# Altium schematic sheet 01-MSP430.SchDoc
size A4; DocumentNumber: 17; SheetNumber: 17; SheetTotal: 34
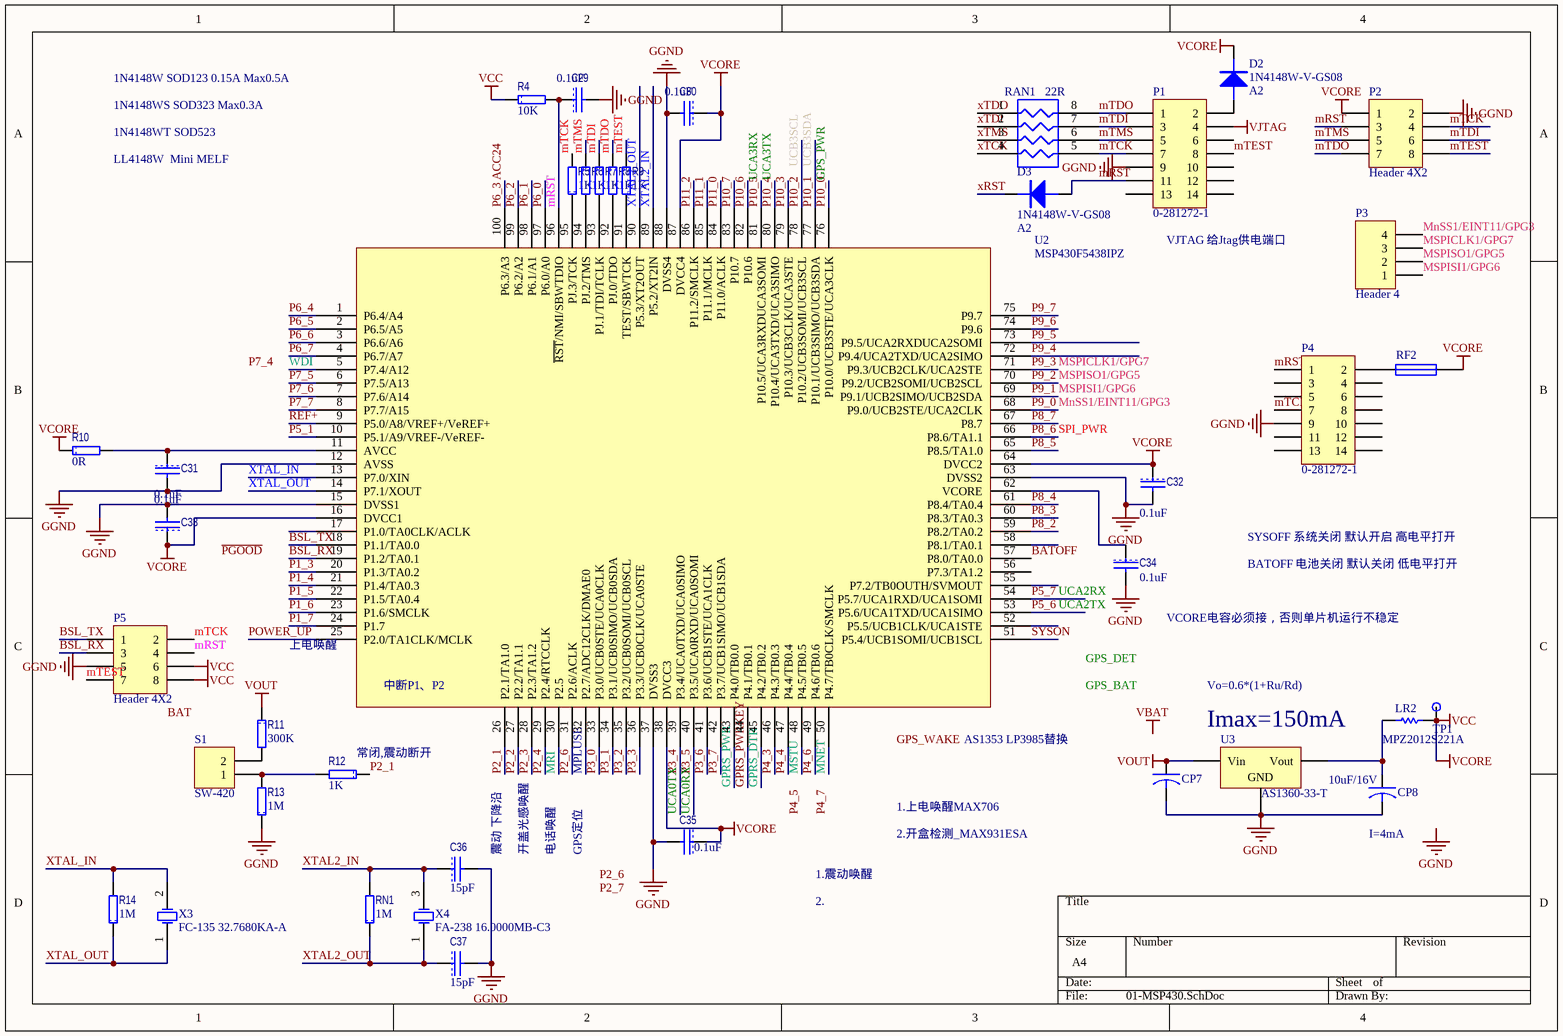
[diagram p0: 01-MSP430.SchDoc]

## Parts
C29  value 0.1uF  [1608[0603]C]  (hidden comment: C1608X7R1H104K)
C30  value 0.1uF  [1608[0603]C]  (hidden comment: C1608X7R1H104K)
C31  value 0.1uF  [1608[0603]C]  (hidden comment: C1608X7R1H104K)
C32  value 0.1uF  [1608[0603]C]  (hidden comment: C1608X7R1H104K)
C33  value 0.1uF  [1608[0603]C]  (hidden comment: C1608X7R1H104K)
C34  value 0.1uF  [1608[0603]C]  (hidden comment: C1608X7R1H104K)
C35  value 0.1uF  [1608[0603]C]  (hidden comment: C1608X7R1H104K)
C36  value 15pF  [1608[0603]]  (hidden comment: C1608C0G1H150J)
C37  value 15pF  [1608[0603]]  (hidden comment: C1608C0G1H150J)
CP7  TAJA106K016RNJ  [3216[1206]CB]  (value not drawn)
CP8  value 10uF/16V  [3216[1206]CB]  (hidden comment: TAJA106K016RNJ)
D2  1N4148W-V-GS08  value A2  [SOD123]
D3  1N4148W-V-GS08  value A2  [SOD123]
LR2  MPZ2012S221A  [2012[0805]]
P1  0-281272-1  [HDR2X7]
P2  Header 4X2  [HDR2X4]
P3  Header 4  [HDR1X4]
P4  0-281272-1  [HDR2X7]
P5  Header 4X2  [HDR2X4]
R4  value 10K  [1608[0603]R]  (hidden comment: CRCW060310K0FKEA)
R5  value 1K  [1608[0603]R]  (hidden comment: CRCW06031K00FKEA)
R6  value 1K  [1608[0603]R]  (hidden comment: CRCW06031K00FKEA)
R7  value 1K  [1608[0603]R]  (hidden comment: CRCW06031K00FKEA)
R8  value 1K  [1608[0603]R]  (hidden comment: CRCW06031K00FKEA)
R9  value 1K  [1608[0603]R]  (hidden comment: CRCW06031K00FKEA)
R10  value 0R  [1608[0603]R]  (hidden comment: CRCW06030000ZSTA)
R11  value 300K  [1608[0603]R]  (hidden comment: CRCW0603300KFKEA)
R12  value 1K  [1608[0603]R]  (hidden comment: CRCW06031K00FKEA)
R13  value 1M  [1608[0603]R]  (hidden comment: CRCW06031M00FKEA)
R14  value 1M  [1608[0603]R]  (hidden comment: CRCW06031M00FKEA)
RAN1  value 22R  [R-AR4]  (hidden comment: CRA06S08322R0JTA)
RF2  0805L050WR  [2012[0805]F]  (value not drawn)
RN1  value 1M  [1608[0603]RN]  (hidden comment: CRCW06031M00FKEA)
S1  SW-420  [SW-420]
TP1  TP  [TP]  (value not drawn)
U2  MSP430F5438IPZ  [TQFP100_N]
U3  AS1360-33-T  [SOT23_N]
X3  FC-135 32.7680KA-A  [FC-135]
X4  FA-238 16.0000MB-C3  [FA-238]

## Nets
GGND: C29.2 C30.2 C31.2 C32.2 C33.2 C34.2 C35.2 C36.2 C37.2 CP7.2 CP8.2 P1.9 P2.2 P4.9 P5.5 R13.1 U2.12(AVSS) U2.15(DVSS1) U2.37(DVSS3) U2.63(DVSS2) U2.88(DVSS4) U3.1(GND)
VCC: C30.1 C32.1 C33.1 C35.1 D2.2(K) LR2.1 P2.1 P5.6 P5.8 R4.1 R10.1 RF2.2 TP1.1(TestPoint) U2.16(DVCC1) U2.38(DVCC3) U2.64(DVCC2) U2.87(DVCC4)  [also labelled VCORE]
VJTAG: P1.4
VOUT: CP7.1 R11.1 U3.3(Vin)
ACC24: U2.100(P6.3/A3)  [also labelled P6_3]
BATOFF: U2.57(P8.0/TA0.0)
BSL_RX: P5.3 U2.19(P1.2/TA0.1)
BSL_TX: P5.1 U2.18(P1.1/TA0.0)
GPRS_DTR: U2.45(P4.2/TB0.2)
GPRS_PWR: U2.43(P4.0/TB0.0)
GPRS_PWRKEY: U2.44(P4.1/TB0.1)
GPS_PWR: U2.76(P10.0/UCB3STE/UCA3CLK)  [also labelled P10_0]
MNET: U2.50(P4.7/TB0CLK/SMCLK)
MnSS1/EINT11/GPG3: P3.4 U2.68(P9.0/UCB2STE/UCA2CLK)  [also labelled P9_0]
MPLUSE: U2.32(P2.7/ADC12CLK/DMAE0)
MRI: U2.30(P2.5)
mRST: C29.1 D3.1(A) P1.11 P2.3 P4.1 P5.4 R4.2 U2.96(~{RST}/NMI/SBWTDIO)
MSPICLK1/GPG7: P3.3 U2.71(P9.3/UCB2CLK/UCA2STE)  [also labelled P9_3]
MSPISI1/GPG6: P3.1 U2.69(P9.1/UCB2SIMO/UCB2SDA)  [also labelled P9_1]
MSPISO1/GPG5: P3.2 U2.70(P9.2/UCB2SOMI/UCB2SCL)  [also labelled P9_2]
MSTU: U2.48(P4.5/TB0.5)
mTCK: P1.7 P2.4 P4.7 P5.2 R5.2 RAN1.5(R4)
mTDI: P1.3 P2.6 R7.1 RAN1.7(R2)
mTDO: P1.1 P2.7 R8.1 RAN1.8(R1)
mTEST: P1.8 P2.8 P5.7 R9.1
mTMS: P1.5 P2.5 R6.1 RAN1.6(R3)
P1_3: U2.20(P1.3/TA0.2)
P1_4: U2.21(P1.4/TA0.3)
P1_5: U2.22(P1.5/TA0.4)
P1_6: U2.23(P1.6/SMCLK)
P1_7: U2.24(P1.7)
P2_1: R12.1 U2.26(P2.1/TA1.0)
P2_2: U2.27(P2.2/TA1.1)
P2_3: U2.28(P2.3/TA1.2)
P2_4: U2.29(P2.4/RTCCLK)
P2_6: U2.31(P2.6/ACLK)
P3_0: U2.33(P3.0/UCB0STE/UCA0CLK)
P3_1: U2.34(P3.1/UCB0SIMO/UCB0SDA)
P3_2: U2.35(P3.2/UCB0SOMI/UCB0SCL)
P3_3: U2.36(P3.3/UCB0CLK/UCA0STE)
P3_4: U2.39(P3.4/UCA0TXD/UCA0SIMO)  [also labelled UCA0TX]
P3_5: U2.40(P3.5/UCA0RXD/UCA0SOMI)  [also labelled UCA0RX]
P3_6: U2.41(P3.6/UCB1STE/UCA1CLK)
P3_7: U2.42(P3.7/UCB1SIMO/UCB1SDA)
P4_3: U2.46(P4.3/TB0.3)
P4_4: U2.47(P4.4/TB0.4)
P4_6: U2.49(P4.6/TB0.6)
P5_1: U2.10(P5.1/A9/VREF-/VeREF-)
P5_6: U2.53(P5.6/UCA1TXD/UCA1SIMO)  [also labelled UCA2TX]
P5_7: U2.54(P5.7/UCA1RXD/UCA1SOMI)  [also labelled UCA2RX]
P6_0: U2.97(P6.0/A0)
P6_1: U2.98(P6.1/A1)
P6_2: U2.99(P6.2/A2)
P6_4: U2.1(P6.4/A4)
P6_5: U2.2(P6.5/A5)
P6_6: U2.3(P6.6/A6)
P6_7: U2.4(P6.7/A7)
P7_5: U2.6(P7.5/A13)
P7_6: U2.7(P7.6/A14)
P7_7: U2.8(P7.7/A15)
P8_2: U2.59(P8.2/TA0.2)
P8_3: U2.60(P8.3/TA0.3)
P8_4: U2.61(P8.4/TA0.4)
P8_5: U2.65(P8.5/TA1.0)
P8_6: U2.66(P8.6/TA1.1)  [also labelled SPI_PWR]
P8_7: U2.67(P8.7)
P9_4: U2.72(P9.4/UCA2TXD/UCA2SIMO)
P9_5: U2.73(P9.5/UCA2RXDUCA2SOMI)
P9_6: U2.74(P9.6)
P9_7: U2.75(P9.7)
P10_1: U2.77(P10.1/UCB3SIMO/UCB3SDA)  [also labelled UCB3SDA]
P10_2: U2.78(P10.2/UCB3SOMI/UCB3SCL)  [also labelled UCB3SCL]
P10_3: U2.79(P10.3/UCB3CLK/UCA3STE)
P10_4: U2.80(P10.4/UCA3TXD/UCA3SIMO)  [also labelled UCA3TX]
P10_5: U2.81(P10.5/UCA3RXDUCA3SOMI)  [also labelled UCA3RX]
P10_6: U2.82(P10.6)
P10_7: U2.83(P10.7)
P11_0: U2.84(P11.0/ACLK)
P11_1: U2.85(P11.1/MCLK)
P11_2: U2.86(P11.2/SMCLK)
POWER_UP: U2.25(P2.0/TA1CLK/MCLK)
REF+: U2.9(P5.0/A8/VREF+/VeREF+)
SYSON: U2.51(P5.4/UCB1SOMI/UCB1SCL)
WDI: U2.5(P7.4/A12)
xRST: D3.2(K)
XTAL2_IN: C36.1 RN1.2 U2.89(P5.2/XT2IN) X4.3(OSC2)
XTAL2_OUT: C37.1 RN1.1 U2.90(P5.3/XT2OUT) X4.1(OSC1)
XTAL_IN: R14.2 U2.13(P7.0/XIN) X3.2(OSC2)
XTAL_OUT: R14.1 U2.14(P7.1/XOUT) X3.1(OSC1)
xTCK: RAN1.4(R4)
xTDI: RAN1.2(R2)
xTDO: RAN1.1(R1)
xTMS: RAN1.3(R3)
NetC31_1: C31.1 R10.2 U2.11(AVCC)
NetC34_1: C34.1 U2.62(VCORE)
NetCP8_1: CP8.1 LR2.2 U3.2(Vout)
NetD2_1: D2.1(A) P1.2
NetR5_1: R5.1 U2.95(PJ.3/TCK)
NetR6_2: R6.2 U2.94(PJ.2/TMS)
NetR7_2: R7.2 U2.93(PJ.1/TDI/TCLK)
NetR8_2: R8.2 U2.92(PJ.0/TDO)
NetR9_2: R9.2 U2.91(TEST/SBWTCK)
NetR11_2: R11.2 S1.2
NetR12_2: R12.2 R13.2 S1.1

Not connected (* = marked no-connect by the designer): P1 6 10 12 13 14; P4 2 3 4 5 6 8 10 11 12 13 14; RF2 1; U2 17(P1.0/TA0CLK/ACLK) 52(P5.5/UCB1CLK/UCA1STE) 55(P7.2/TB0OUTH/SVMOUT) 56(P7.3/TA1.2) 58(P8.1/TA0.1)

## Notes on the sheet
- 1N4148W SOD123 0.15A Max0.5A
- 1N4148WS SOD323 Max0.3A
- 1N4148WT SOD523
- LL4148W  Mini MELF
- (near P1) VJTAG 给Jtag供电端口
- BATOFF 电池关闭 默认关闭 低电平打开
- SYSOFF 系统关闭 默认开启 高电平打开
- (near U2) 上电唤醒
- VCORE电容必须接，否则单片机运行不稳定
- (near U2) 中断P1、P2
- Vo=0.6*(1+Ru/Rd)
- (near R12) 常闭,震动断开
- (near U2) AS1353 LP3985替换
- (near U3) Imax=150mA
- (near C36) 震动 下降沿
- 开盖光感唤醒
- 电话唤醒
- GPS定位
- 1.上电唤醒MAX706
- 2.开盒检测_MAX931ESA
- (near CP8) I=4mA
- 1.震动唤醒
- 2.
- Labels drawn without touching a wire or pin: BAT, GGND, GPS_BAT, GPS_DET, GPS_WAKE, P2_6, P2_7, P4_5, P4_7, P7_4, VBAT, ~{PGOOD}

## Library data of the parts
C29-C35 = CAP: 多层陶瓷电容器MLCC - SMD/SMT 0603 0.1uF 50volts X7R 10%; Manufacturer: TDK; 产品: General Type MLCCs; 产品种类: Low & Medium Capacitance SMD Ceramic Chip Capacitors; 外壳代码 - in: 0603; 外壳代码 - mm: 1608; 封装 / 箱体: 0603 (1608 metric); 封装: Reel; 尺寸: 0.8 mm W x 1.6 mm L x 0.8 mm H; 工作温度范围: - 55 C to + 125 C; 标准包装数量: 4000; 电压额定值: 50 V; 电容-nF: 100 nF; 电容-pF: 100000 pF; 系列: C; Category: 多层陶瓷电容器MLCC - SMD/SMT; ComponentLink1Description: http://www.tdk.com/pdf/general_B11.pdf; ComponentLink1URL: http://www.tdk.com/pdf/general_B11.pdf; Description 1: 多层陶瓷电容器MLCC - SMD/SMT 0603 0.1uF 50volts X7R 10%; Manufacturer Part Number: C1608X7R1H104K; Minimum Order Quantity: 1; Pricing 1: 1=0.160, 50=0.070, 100=0.036, 500=0.019, 1000=0.013, 4000=0.010, 8000=0.009, 12000=0.008, 20000=0.007 (USD); Reeling: True; RoHS - 贸泽: Y; RoHS: RoHS Compliant; Stock 1: 224604; Supplier 1: Mouser; Supplier Part Number 1: 810-C1608X7R1H104K; 制造商: TDK; 容差: 10 %; 温度系数/代码: X7R; 电容: 0.1 uF; 端接类型: SMD/SMT
C36 C37 = CAP: 多层陶瓷电容器MLCC - SMD/SMT 0603 15pF 50volts C0G 5%; Manufacturer: TDK; 尺寸: 0.8 mm W x 1.6 mm L x 0.8 mm H; 工作温度范围: - 55 C to + 125 C; 封装 / 箱体: 0603 (1608 metric); 封装: Reel; 产品: General Type MLCCs; 系列: C; 电压额定值: 50 V; 外壳代码 - in: 0603; 外壳代码 - mm: 1608; 产品种类: Low & Medium Capacitance SMD Ceramic Chip Capacitors; 标准包装数量: 4000; 温度系数/代码: C0G (NP0); Supplier 1: Mouser; Supplier Part Number 1: 810-C1608C0G1H150J; Manufacturer Part Number: C1608C0G1H150J; RoHS: RoHS Compliant; Description 1: 多层陶瓷电容器MLCC - SMD/SMT 0603 15pF 50volts C0G 5%; Category: 多层陶瓷电容器MLCC - SMD/SMT; Stock 1: 9174; Pricing 1: 1=0.090, 50=0.020, 100=0.013, 500=0.008, 1000=0.007, 4000=0.007, 8000=0.006, 12000=0.005, 20000=0.004 (USD); 电容: 15 pF; 端接类型: SMD/SMT; 容差: 5 %; 制造商: TDK; RoHS - 贸泽: Y; Minimum Order Quantity: 1; Reeling: True; ComponentLink1URL: http://www.tdk.com/pdf/general_B11.pdf; ComponentLink1Description: http://www.tdk.com/pdf/general_B11.pdf
CP7 CP8 = CAPACITOR: 钽质电容器-固体SMD 16volts 10uF 10%; Manufacturer: AVX; ESR: 3 Ohms; 产品: Tantalum Solid Standard Grade - Other Various; 产品种类: SMD Tantalum Capacitors; 制造商库存号: A Case; 外壳代码 - in: 1206; 外壳代码 - mm: 3216; 封装 / 箱体: 1206 (3216 metric); 封装: Reel; 尺寸: 1.6 mm W x 3.2 mm L; 工作温度范围: - 55 C to + 125 C; 损耗因数 DF: 8; 标准包装数量: 2000; 漏泄电流: 1.6 uA; 电压额定值: 16 V; 端接类型: SMD/SMT; 系列: TAJ; 高度: 1.8 mm; Category: 钽质电容器-固体SMD; ComponentLink1Description: http://www.avx.com/docs/Catalogs/taj.pdf; ComponentLink1URL: http://www.avx.com/docs/Catalogs/taj.pdf; Description 1: 钽质电容器-固体SMD 16volts 10uF 10%; Manufacturer Part Number: TAJA106K016RNJ; Minimum Order Quantity: 1; Pricing 1: 1=0.600, 100=0.280, 200=0.250, 500=0.221, 1000=0.200, 2000=0.140, 5000=0.131, 10000=0.124, 25000=0.103 (USD); Reeling: True; RoHS - 贸泽: Y; RoHS: RoHS Compliant; Stock 1: 20335; Supplier 1: Mouser; Supplier Part Number 1: 581-TAJA106K016R; 制造商: AVX; 容差: 10 %; 电容: 10 uF
D2 D3 = 1N4148W: 二极管 - 通用，功率，开关 100V Io/150mA; Manufacturer: Vishay Semiconductors; 配置: Single; 工作温度范围: - 65 C to + 150 C; 封装 / 箱体: SOD-123; 封装: Reel; 产品: Switching Diodes; 正向连续电流: 0.15 A; 最大浪涌电流: 0.5 A; 安装风格: SMD/SMT; 恢复时间: 4 ns; 正向电压下降: 1.2 V; 制造商: Vishay; 最大二极管电容: 4 pF; 最大工作温度: + 150 C; 最大功率耗散: 350 mW; 最大反向漏泄电流: 5 uA; 最小工作温度: - 65 C; 标准包装数量: 15000; Supplier 1: Mouser; Supplier Part Number 1: 625-1N4148W-V; Manufacturer Part Number: 1N4148W-V-GS08; RoHS: RoHS Compliant; Category: 二极管 - 通用，功率，开关; Stock 1: 404148; Pricing 1: 1=0.090, 10=0.083, 50=0.072, 100=0.068, 500=0.032, 1000=0.026, 3000=0.021, 9000=0.016, 10000=0.016, 18000=0.014 (USD); 峰值反向电压: 100 V; 产品种类: Switching Diodes; RoHS - 贸泽: Y; Minimum Order Quantity: 1; Reeling: True; ComponentLink1URL: http://www.mouser.com/ds/2/427/1n4148w--240387.pdf; ComponentLink1Description: http://www.mouser.com/ds/2/427/1n4148w--240387.pdf; Description 1: 二极管 - 通用，功率，开关 100V Io/150mA
LR2 = Res Semi: 电磁干扰滤波珠子、扼流圈和阵列 Ferrite Chip Beads; Manufacturer: TDK; 阻抗: 220 Ohms; 最大直流电流: 3 A; 最大直流电阻: 0.04 Ohms; 工作温度范围: - 55 C to + 125 C; 封装 / 箱体: 2012; 封装: Reel; 端接类型: SMD/SMT; 容差: 25 %; 产品种类: Ferrite Beads; 标准包装数量: 4000; Supplier 1: Mouser; Supplier Part Number 1: 810-MPZ2012S221A; Manufacturer Part Number: MPZ2012S221A; RoHS: RoHS Compliant; Description 1: 电磁干扰滤波珠子、扼流圈和阵列 Ferrite Chip Beads; Category: 电磁干扰滤波珠子、扼流圈和阵列; Stock 1: 26540; Pricing 1: 1=0.070, 50=0.060, 100=0.053, 500=0.040, 1000=0.035, 4000=0.031, 8000=0.029, 12000=0.025 (USD); 制造商: TDK; RoHS - 贸泽: Y; Minimum Order Quantity: 1; Reeling: True; ComponentLink1URL: http://www.mouser.com/ds/2/400/e9413_mpz-24582.pdf; ComponentLink1Description: http://www.mouser.com/ds/2/400/e9413_mpz-24582.pdf
P1 P4 = Header 7X2: TE CONNECTIVITY 2.54mm / AMP - 0-281272-1 - HEADER STRAIGHT 14WAY; Manufacturer: TE CONNECTIVITY / AMP; Description 1: TE CONNECTIVITY / AMP - 0-281272-1 - HEADER STRAIGHT 14WAY; Product Range: TE - AMP-LATCH Series; Contact Termination: Through Hole Vertical; No. of Contacts: 14; No. of Rows: 2; Pitch Spacing: 2.54; Supplier 1: Farnell; Supplier Part Number 1: 3816266; Manufacturer Part Number: 0-281272-1; RoHS: YES; Stock 1: 25; Pricing 1: 1=6.14 (CNY); Gender: Header; Contact Plating: Gold; Contact Material: Brass; Lead Spacing: 2.54; Termination Method: Solder; ComponentLink1URL: http://www.farnell.com/cad/1656189.pdf; ComponentLink1Description: http://www.farnell.com/cad/1656189.pdf; ComponentLink2URL: http://www.farnell.com/datasheets/55305.pdf; ComponentLink2Description: http://www.farnell.com/datasheets/55305.pdf
P2 P5 = Header 4X2: 插针 Header, 4-Pin, Dual row; LatestRevisionDate: 17-Jul-2002; LatestRevisionNote: Re-released for DXP Platform.; Publisher: Altium Limited
P3 = Header 4: 插针 Header, 4-Pin; LatestRevisionDate: 17-Jul-2002; LatestRevisionNote: Re-released for DXP Platform.; Publisher: Altium Limited
R4 = RES: 厚膜电阻器 - SMD 1/10watt 10Kohms 1%; Manufacturer: Vishay / Dale; 尺寸: 0.85 mm W x 1.55 mm L x 0.45 mm H; 工作温度范围: - 55 C to + 155 C; 封装 / 箱体: 0603 (1608 metric); 封装: Reel; 功率额定值: 100 mW; 产品: Thick Film Resistors SMD; 系列: CRCW; 温度系数: 100 PPM / K; 端接类型: SMD/SMT; 电压额定值: 75 V; 制造商: Vishay; 产品种类: 0603 Thick Film Chip Resistors; 标准包装数量: 5000; 外壳代码 - in: 0603; 外壳代码 - mm: 1608; Supplier 1: Mouser; Supplier Part Number 1: 71-CRCW0603-10K-E3; Manufacturer Part Number: CRCW060310K0FKEA; RoHS: RoHS Compliant By Exemption; Category: 厚膜电阻器 - SMD; Stock 1: 0; Pricing 1: 1=0.080, 10=0.013, 100=0.010, 1000=0.008, 5000=0.005, 25000=0.004, 50000=0.003 (USD); 电阻: 10 kOhms; 容差: 1 %; RoHS - 贸泽: E; Minimum Order Quantity: 1; Reeling: True; ComponentLink1URL: http://www.mouser.com/ds/2/427/dcrcwe3-109170.pdf; ComponentLink1Description: http://www.mouser.com/ds/2/427/dcrcwe3-109170.pdf; Description 1: 厚膜电阻器 - SMD 1/10watt 10Kohms 1%
R5-R9 R12 = RES: 厚膜电阻器 - SMD 1/10watt 1.0Kohms 1%; Manufacturer: Vishay / Dale; 尺寸: 0.85 mm W x 1.55 mm L x 0.45 mm H; 工作温度范围: - 55 C to + 155 C; 封装 / 箱体: 0603 (1608 metric); 封装: Reel; 功率额定值: 100 mW; 产品: Thick Film Resistors SMD; 电阻: 1 kOhms; 系列: CRCW; 温度系数: 100 PPM / K; 端接类型: SMD/SMT; 电压额定值: 75 V; 制造商: Vishay; 产品种类: 0603 Thick Film Chip Resistors; 标准包装数量: 5000; 外壳代码 - in: 0603; 外壳代码 - mm: 1608; Supplier 1: Mouser; Supplier Part Number 1: 71-CRCW0603-1.0K-E3; Manufacturer Part Number: CRCW06031K00FKEA; RoHS: RoHS Compliant By Exemption; Category: 厚膜电阻器 - SMD; Stock 1: 276938; Pricing 1: 1=0.080, 10=0.013, 100=0.010, 1000=0.008, 5000=0.005, 25000=0.004, 50000=0.003 (USD); 容差: 1 %; RoHS - 贸泽: E; Minimum Order Quantity: 1; Reeling: True; ComponentLink1URL: http://www.mouser.com/ds/2/427/dcrcwe3-109170.pdf; ComponentLink1Description: http://www.mouser.com/ds/2/427/dcrcwe3-109170.pdf; Description 1: 厚膜电阻器 - SMD 1/10watt 1.0Kohms 1%
R10 = RES: 厚膜电阻器 - SMD 1/10watt ZEROohm Jumper; Manufacturer: Vishay / Dale; 尺寸: 0.85 mm W x 1.55 mm L x 0.45 mm H; 工作温度范围: - 55 C to + 155 C; 封装 / 箱体: 0603 (1608 metric); 封装: Reel; 功率额定值: 100 mW; 产品: Thick Film Resistors Zero-Ohm; 电阻: 0 Ohms; 系列: CRCW; 温度系数: 200 PPM / C; 端接类型: SMD/SMT; 容差: 1 %; 电压额定值: 75 V; 外壳代码 - in: 0603; 外壳代码 - mm: 1608; 制造商: Vishay; 产品种类: 0603 Thick Film Chip Resistors; 标准包装数量: 5000; Supplier 1: Mouser; Supplier Part Number 1: 71-CRCW0603-0; Manufacturer Part Number: CRCW06030000ZSTA; RoHS: No; Category: 厚膜电阻器 - SMD; Stock 1: 44945; Pricing 1: 1=0.110, 10=0.064, 100=0.036, 1000=0.024, 5000=0.010, 10000=0.009, 25000=0.008, 50000=0.006 (USD); RoHS - 贸泽: N; Minimum Order Quantity: 1; Reeling: True; ComponentLink1URL: http://www.mouser.com/ds/2/427/dcrcw-72725.pdf; ComponentLink1Description: http://www.mouser.com/ds/2/427/dcrcw-72725.pdf; Description 1: 厚膜电阻器 - SMD 1/10watt ZEROohm Jumper
R11 = RES: 厚膜电阻器 - SMD 1/10watt 300Kohms 1%; Manufacturer: Vishay / Dale; Manufacturer Part Number: CRCW0603100KFKEA; 尺寸: 0.85 mm W x 1.55 mm L x 0.45 mm H; 工作温度范围: - 55 C to + 155 C; 封装 / 箱体: 0603 (1608 metric); 封装: Reel; 功率额定值: 100 mW; 产品: Thick Film Resistors SMD; 电阻: 100 kOhms; 系列: CRCW; 温度系数: 100 PPM / K; 端接类型: SMD/SMT; 电压额定值: 75 V; 制造商: Vishay; 产品种类: 0603 Thick Film Chip Resistors; 标准包装数量: 5000; Description 1: 厚膜电阻器 - SMD 1/10watt 100Kohms 1%; 外壳代码 - in: 0603; 外壳代码 - mm: 1608; Supplier 1: Mouser; Supplier Part Number 1: 71-CRCW0603-100K-E3; RoHS: RoHS Compliant By Exemption; Category: 厚膜电阻器 - SMD; Stock 1: 175756; Pricing 1: 1=0.080, 10=0.013, 100=0.010, 1000=0.008, 5000=0.005, 25000=0.004, 50000=0.003 (USD); 容差: 1 %; RoHS - 贸泽: E; Minimum Order Quantity: 1; Reeling: True; ComponentLink1URL: http://www.mouser.com/ds/2/427/dcrcwe3-109170.pdf; ComponentLink1Description: http://www.mouser.com/ds/2/427/dcrcwe3-109170.pdf
R13 R14 RN1 = RES: 厚膜电阻器 - SMD 1/10watt 1.0Mohms 1%; Manufacturer: Vishay / Dale; 尺寸: 0.85 mm W x 1.55 mm L x 0.45 mm H; 工作温度范围: - 55 C to + 155 C; 封装 / 箱体: 0603 (1608 metric); 封装: Reel; 功率额定值: 100 mW; 产品: Thick Film Resistors SMD; 电阻: 1 MOhms; 系列: CRCW; 温度系数: 100 PPM / K; 端接类型: SMD/SMT; 电压额定值: 75 V; 外壳代码 - in: 0603; 外壳代码 - mm: 1608; 制造商: Vishay; 产品种类: 0603 Thick Film Chip Resistors; 标准包装数量: 5000; Supplier 1: Mouser; Supplier Part Number 1: 71-CRCW0603-1.0M-E3; Manufacturer Part Number: CRCW06031M00FKEA; RoHS: RoHS Compliant By Exemption; Category: 厚膜电阻器 - SMD; Stock 1: 71394; Pricing 1: 1=0.080, 10=0.013, 100=0.010, 1000=0.008, 5000=0.005, 25000=0.004, 50000=0.003 (USD); 容差: 1 %; RoHS - 贸泽: E; Minimum Order Quantity: 1; Reeling: True; ComponentLink1URL: http://www.mouser.com/ds/2/427/dcrcwe3-109170.pdf; ComponentLink1Description: http://www.mouser.com/ds/2/427/dcrcwe3-109170.pdf; Description 1: 厚膜电阻器 - SMD 1/10watt 1.0Mohms 1%
RAN1 = RP4R: 电阻器网络与阵列 8Term 22ohms 5% Convex; Manufacturer: Vishay / Dale; 尺寸: 1.5 mm W x 1.6 mm L x 0.5 mm H; 工作温度范围: - 55 C to + 150 C; 封装: Reel; 系列: CRA06; 温度系数: 200 PPM / K; 端接类型: SMD/SMT; 电路类型: Isolated; 管脚数量: 8; 电阻器数量: 4; 引线间隔: 0.8 mm; 制造商: Vishay; 产品种类: Thick Film Resistor Arrays; 产品类型: Arrays; Supplier 1: Mouser; Supplier Part Number 1: 71-CRA06S08322R0JTA; Manufacturer Part Number: CRA06S08322R0JTA; RoHS: RoHS Compliant By Exemption; Description 1: 电阻器网络与阵列 8Term 22ohms 5% Convex; Category: 电阻器网络与阵列; Stock 1: 1674; Pricing 1: 1=0.090, 100=0.080, 500=0.070, 1000=0.056, 5000=0.051, 10000=0.050, 25000=0.044 (USD); 容差: 5 %; 电阻数值: 22 Ohms; RoHS - 贸泽: E; Minimum Order Quantity: 1; Reeling: True; ComponentLink1URL: http://www.mouser.com/ds/2/427/cra06es-73101.pdf; ComponentLink1Description: http://www.mouser.com/ds/2/427/cra06es-73101.pdf
RF2 = FUSE1: 可复位保险丝 PTC 30V POLY SURF MOUNT 0805 .500A; Manufacturer: Littelfuse; Resistance: 850 mOhms; Current Rating (Max): 100 A; Hold Current: 0.5 A; Maximum Voltage: 6 VDC; Trip Current: 1 A; Supplier 1: Mouser; Supplier Part Number 1: 576-0805L050; Manufacturer Part Number: 0805L050WR; RoHS: RoHS Compliant; Category: Resettable Fuses - PPTC; Stock 1: 4103; Pricing 1: 1=3.25, 10=2.61, 50=2.39, 100=2.12, 200=2.07, 500=1.74, 1000=1.49, 3000=1.40, 6000=1.35 (AUD); Dimensions: 2.2 mm L x 1.5 mm W x 1.25 mm  H; Operating Temperature Range: - 40 C to + 85 C; Package / Case: 0805 (2012 metric); Packaging: Reel; Series: 0805L; Termination Style: SMD/SMT; Type: PolyFuse Resettable PTC; Mounting Style: SMD/SMT; Product Category: Resettable PTCs; Standard Pack Qty: 3000; RoHS - Mouser: Y; Minimum Order Quantity: 1; Reeling: True; ComponentLink1URL: http://www.mouser.com/ds/2/240/Littelfuse_0805L-32472.pdf; ComponentLink1Description: http://www.mouser.com/ds/2/240/Littelfuse_0805L-32472.pdf
S1 = Header 2: 插针 工业级震动传感器; 公司: 百灵电子; LatestRevisionDate: 17-Jul-2002; LatestRevisionNote: Re-released for DXP Platform.; Publisher: Altium Limited
TP1 = Test Point
U2 = MSP430F5438: IC MCU 16BIT 256K FLASH 100-LQFP; Manufacturer: Texas Instruments; Manufacturer Part Number: MSP430F5438IPZR; 公司: TI; Core Size: 16-Bit; Speed: 18MHz; Connectivity: I2C, IrDA, LIN, SCI, SPI, UART/USART; Peripherals: Brown-out Detect/Reset, DMA, POR, PWM, WDT; Number of I /O: 87; Program Memory Size: 256KB (256K x 8); RAM Size: 16K x 8; Voltage - Supply (Vcc/Vdd): 2.2 V ~ 3.6 V; Data Converters: A/D 16x12b; Oscillator Type: External; Supplier 1: Digi-Key; Supplier Part Number 1: 296-23859-1-ND; RoHS: RoHS Compliant; Description 1: IC MCU 16BIT 256K FLASH 100-LQFP; Category: Integrated Circuits (ICs); Stock 1: 10552; Pricing 1: 1=9.98, 10=8.978, 25=8.1656, 100=7.3917, 250=6.77252, 500=6.192 (USD); Packaging: Cut Tape (CT); Core Processor: -; Program Memory Type: FLASH; EEPROM Size: -; Operating Temperature: -40°C ~ 85°C; Package / Case: 100-LQFP; ComponentLink1URL: http://www.ti.com/lit/ds/symlink/msp430f5438.pdf; ComponentLink1Description: http://www.ti.com/lit/ds/symlink/msp430f5438.pdf
U3 = Volt Reg: LDO Voltage Controllers; Manufacturer: ams; Input Voltage MAX: 20 V; Output Current: 150 mA; Output Voltage: 3.3 V; Product Status: New at Mouser; Supplier 1: Mouser; Supplier Part Number 1: 985-AS1360-33-T; Manufacturer Part Number: AS1360-33-T; RoHS: RoHS Compliant; Category: LDO Voltage Controllers; Stock 1: 4086; Pricing 1: 1=1.82, 10=1.46, 100=1.12, 500=0.991, 1000=0.783, 2500=0.730, 5000=0.695, 10000=0.680 (AUD); Package / Case: SOT-23-3; Packaging: Reel; Mounting Style: SMD/SMT; Maximum Operating Temperature: + 85 C; Minimum Operating Temperature: - 40 C; RoHS - Mouser: Y; Minimum Order Quantity: 1; Reeling: True; ComponentLink1URL: http://ams.com/eng/content/download/1325/7334/424; ComponentLink1Description: http://ams.com/eng/content/download/1325/7334/424
X3 = XTAL: 晶体 32.768KHz 20ppm 12.5pF -40C -85C; Manufacturer: Epson Toyocom; 尺寸: 1.5 mm W x 3.2 mm L x 0.8 mm H; 工作温度范围: - 40 C to + 85 C; 封装: Bulk; 系列: FC; 端接类型: SMD/SMT; ESR: 70 KOhms; 制造商: Epson; 产品种类: .; Supplier 1: Mouser; Supplier Part Number 1: 732-FC135-32.76KAA; Manufacturer Part Number: FC-135 32.7680KA-A; RoHS: RoHS Compliant; Description 1: 晶体 32.768KHz 20ppm 12.5pF -40C -85C; Category: 晶体; Stock 1: 0; Pricing 1: 1=1.16, 10=0.900, 100=0.855, 500=0.765, 1000=0.674, 2500=0.652, 5000=0.629, 10000=0.607 (USD); 频率: 32.768 kHz; 频率稳定性: 20 PPM; 负载电容: 12.5 pF; RoHS - 贸泽: Y; Minimum Order Quantity: 1; Reeling: False; ComponentLink1URL: http://www.eea.epson.com/portal/pls/portal/docs/1/1349455.PDF; ComponentLink1Description: http://www.eea.epson.com/portal/pls/portal/docs/1/1349455.PDF
X4 = XTAL: CRYSTAL 16MHZ 18PF SMD; Manufacturer: EPSON; Frequency Stability: ±30ppm; Frequency Tolerance: ±50ppm; ESR (Equivalent Series Resistance): 80 Ohm; Operating Mode: Fundamental; Supplier 1: Digi-Key; Supplier Part Number 1: SER3686CT-ND; Manufacturer Part Number: FA-238 16.0000MB-C3; RoHS: RoHS Compliant; Description 1: CRYSTAL 16MHZ 18PF SMD; Category: Crystals and Oscillators; Stock 1: 2666; Pricing 1: 1=0.69, 10=0.579, 50=0.5192, 100=0.462 (USD); Packaging: Cut Tape (CT); Type: MHz Crystal; Frequency: 16MHz; Load Capacitance: 18pF; Operating Temperature: -20°C ~ 70°C; Ratings: -; Mounting Type: Surface Mount; Package / Case: 4-SMD, No Lead (DFN, LCC); Size / Dimension: 0.126" L x 0.098" W (3.20mm x 2.50mm); Height: 0.028" (0.70mm); ComponentLink1URL: http://www.eea.epson.com/portal/pls/portal/docs/1/1531444.PDF; ComponentLink1Description: http://www.eea.epson.com/portal/pls/portal/docs/1/1531444.PDF